# Altium schematic sheet top_sheet.SchDoc
size A4
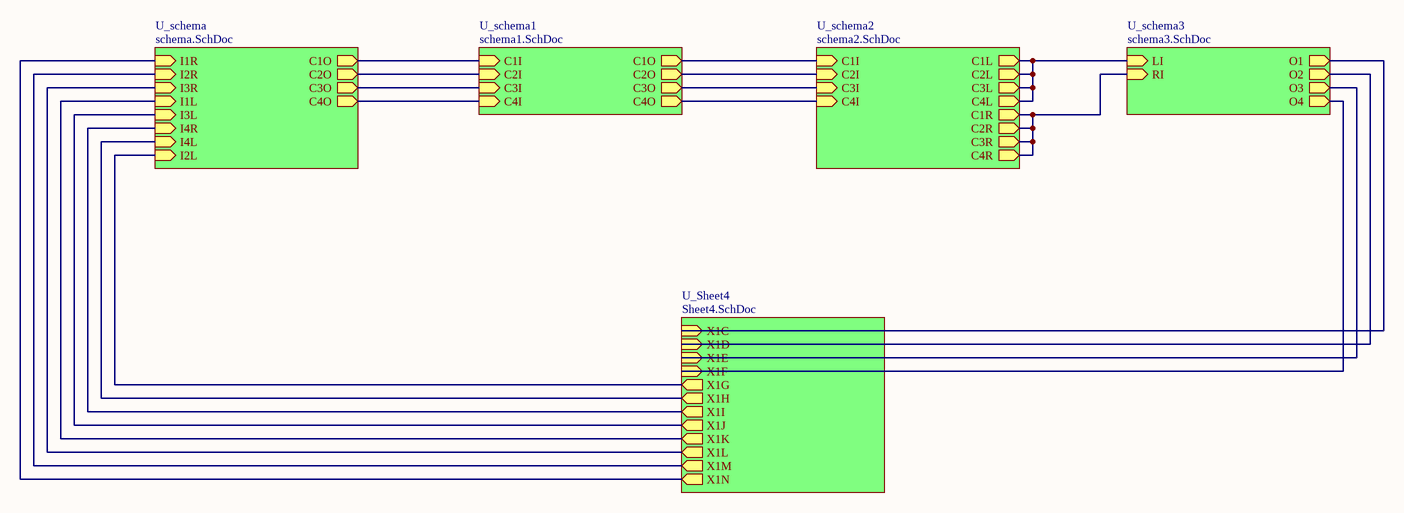
[diagram p0: top_sheet.SchDoc]

## Sub-sheets
U_schema = schema.SchDoc: C1O (out), C2O (out), C3O (out), C4O (out), I1R (in), I2R (in), I3R (in), I1L (in), I3L (in), I4R (in), I4L (in), I2L (in)
U_schema1 = schema1.SchDoc: C1I (in), C2I (in), C3I (in), C4I (in), C1O (out), C2O (out), C4O (out), C3O (out)
U_schema2 = schema2.SchDoc: C1I (in), C2I (in), C3I (in), C4I (in), C1L (out), C1R (out), C2L (out), C2R (out), C3L (out), C3R (out), C4L (out), C4R (out)
U_schema3 = schema3.SchDoc: LI (in), RI (in), O1 (out), O2 (out), O3 (out), O4 (out)
U_Sheet4 = Sheet4.SchDoc: X1C (in), X1D (in), X1E (in), X1F (in), X1G (out), X1H (out), X1I (out), X1J (out), X1K (out), X1L (out), X1M (out), X1N (out)

## Nets
(unnamed): sheet U_Sheet4/X1C, sheet U_schema3/O1
(unnamed): sheet U_Sheet4/X1D, sheet U_schema3/O2
(unnamed): sheet U_Sheet4/X1E, sheet U_schema3/O3
(unnamed): sheet U_Sheet4/X1F, sheet U_schema3/O4
(unnamed): sheet U_Sheet4/X1G, sheet U_schema/I2L
(unnamed): sheet U_Sheet4/X1H, sheet U_schema/I4L
(unnamed): sheet U_Sheet4/X1I, sheet U_schema/I4R
(unnamed): sheet U_Sheet4/X1J, sheet U_schema/I3L
(unnamed): sheet U_Sheet4/X1K, sheet U_schema/I1L
(unnamed): sheet U_Sheet4/X1L, sheet U_schema/I3R
(unnamed): sheet U_Sheet4/X1M, sheet U_schema/I2R
(unnamed): sheet U_Sheet4/X1N, sheet U_schema/I1R
(unnamed): sheet U_schema/C1O, sheet U_schema1/C1I
(unnamed): sheet U_schema/C2O, sheet U_schema1/C2I
(unnamed): sheet U_schema/C3O, sheet U_schema1/C3I
(unnamed): sheet U_schema/C4O, sheet U_schema1/C4I
(unnamed): sheet U_schema1/C1O, sheet U_schema2/C1I
(unnamed): sheet U_schema1/C2O, sheet U_schema2/C2I
(unnamed): sheet U_schema1/C4O, sheet U_schema2/C4I
(unnamed): sheet U_schema1/C3O, sheet U_schema2/C3I
(unnamed): sheet U_schema2/C1L, sheet U_schema2/C2L, sheet U_schema2/C3L, sheet U_schema2/C4L, sheet U_schema3/LI
(unnamed): sheet U_schema2/C1R, sheet U_schema2/C2R, sheet U_schema2/C3R, sheet U_schema2/C4R, sheet U_schema3/RI